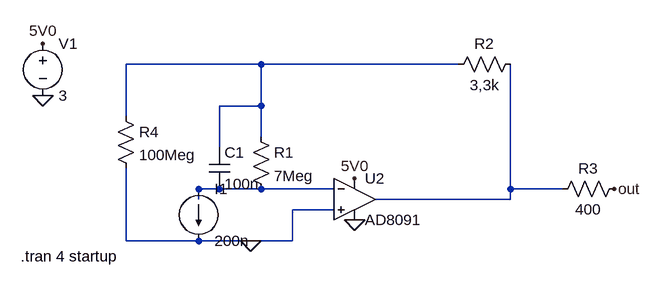
[diagram p0: schematic SimUVopamp.asc]
SimUVopamp.asc, the LTspice schematic file:
Version 4
SHEET 1 880 680
WIRE 80 -64 -128 -64
WIRE 384 -64 80 -64
WIRE 80 0 80 -64
WIRE 80 0 16 0
WIRE -128 16 -128 -64
WIRE 80 48 80 0
WIRE 16 64 16 0
WIRE 16 128 -16 128
WIRE 80 128 16 128
WIRE 192 128 80 128
WIRE 464 128 464 -64
WIRE 544 128 464 128
WIRE -16 144 -16 128
WIRE 464 144 464 128
WIRE 464 144 256 144
WIRE 192 160 128 160
WIRE -128 208 -128 96
WIRE -16 208 -128 208
WIRE 64 208 -16 208
WIRE 128 208 128 160
WIRE 128 208 64 208
FLAG 64 208 0
FLAG 224 176 0
FLAG -256 -16 0
FLAG -256 -96 5V0
FLAG 224 112 5V0
FLAG 624 128 out
SYMBOL res 64 32 R0
SYMATTR InstName R1
SYMATTR Value 7Meg
SYMBOL res 480 -80 R90
WINDOW 0 0 56 VBottom 2
WINDOW 3 32 56 VTop 2
SYMATTR InstName R2
SYMATTR Value 3,3k
SYMBOL res 640 112 R90
WINDOW 0 0 56 VBottom 2
WINDOW 3 32 56 VTop 2
SYMATTR InstName R3
SYMATTR Value 400
SYMBOL voltage -256 -112 R0
WINDOW 123 0 0 Left 0
WINDOW 39 0 0 Left 0
SYMATTR InstName V1
SYMATTR Value 3
SYMBOL Opamps\\AD8091 224 80 R0
SYMATTR InstName U2
SYMBOL cap 0 64 R0
SYMATTR InstName C1
SYMATTR Value 100n
SYMBOL current -16 128 R0
WINDOW 123 0 0 Left 0
WINDOW 39 0 0 Left 0
SYMATTR InstName I1
SYMATTR Value 200n
SYMBOL res -144 0 R0
SYMATTR InstName R4
SYMATTR Value 100Meg
TEXT -290 232 Left 2 !.tran 4 startup

The netlist it stands for:
* SimUVopamp.asc
R1 N001 N002 7Meg
R2 N003 N001 3,3k
R3 out N003 400
V1 5V0 0 3
XU2 0 N002 5V0 0 N003 AD8091  ; pins In+ In- V+ V- OUT
C1 N001 N002 100n
I1 N002 0 200n
R4 N001 0 100Meg
.tran 4 startup
.backanno
.end